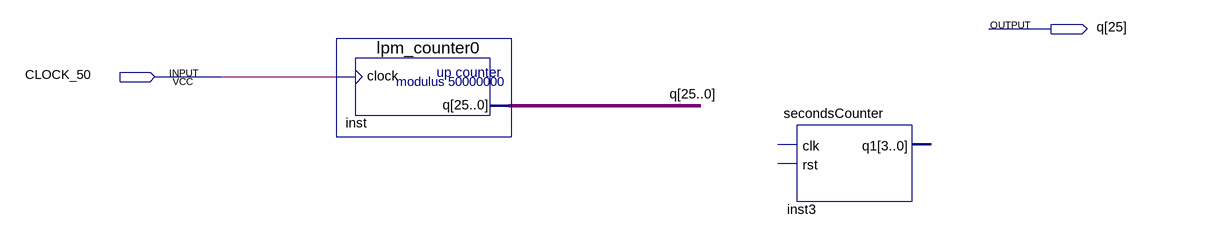
[diagram p0: schematic sheet]
// Quartus schematic zegar.bdf as structural Verilog: 2 symbols, 2 pins
module zegar (
  input  CLOCK_50,
  output [25:0] q
);

  lpm_counter0 inst (.clock(CLOCK_50), .q(q));
  secondsCounter inst3 ();  // open: clk, rst, q1
endmodule
